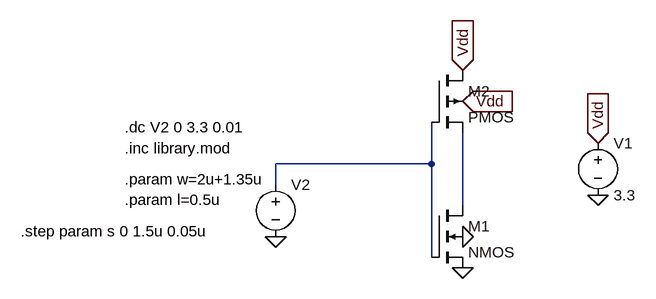
[diagram p0: schematic quiz1.asc]
quiz1.asc, the LTspice schematic file:
Version 4
SHEET 1 880 680
WIRE 240 112 240 48
WIRE 240 112 0 112
WIRE 0 144 0 112
WIRE 288 176 288 64
WIRE 240 256 240 112
FLAG 496 80 Vdd
IOPIN 496 80 In
FLAG 288 16 Vdd
IOPIN 288 16 In
FLAG 288 -32 Vdd
IOPIN 288 -32 In
FLAG 496 160 0
FLAG 288 224 0
FLAG 0 224 0
FLAG 288 272 0
SYMBOL voltage 0 128 R0
SYMATTR InstName V2
SYMATTR Value ""
SYMBOL voltage 496 64 R0
WINDOW 123 0 0 Left 0
WINDOW 39 0 0 Left 0
SYMATTR InstName V1
SYMATTR Value 3.3
SYMBOL nmos4 240 176 R0
SYMATTR InstName M1
SYMATTR Value2 l=0.5u w=1u
SYMBOL pmos4 240 -32 R0
SYMATTR InstName M2
SYMATTR Value2 l=l w=w
TEXT -232 56 Left 2 !.dc V2 0 3.3 0.01
TEXT -232 88 Left 2 !.inc library.mod
TEXT -232 136 Left 2 !.param w=2u+1.35u\n.param l=0.5u
TEXT -392 216 Left 2 !.step param s 0 1.5u 0.05u

The netlist it stands for:
* quiz1.asc
V2 N001 0
V1 Vdd 0 3.3
M1 N002 N001 0 0 NMOS l=0.5u w=1u
M2 Vdd N001 N002 Vdd PMOS l=l w=w
.model NMOS NMOS
.model PMOS PMOS
.lib standard.mos
.dc V2 0 3.3 0.01
.inc library.mod
.param w=2u+1.35u
.param l=0.5u
.step param s 0 1.5u 0.05u
.backanno
.end